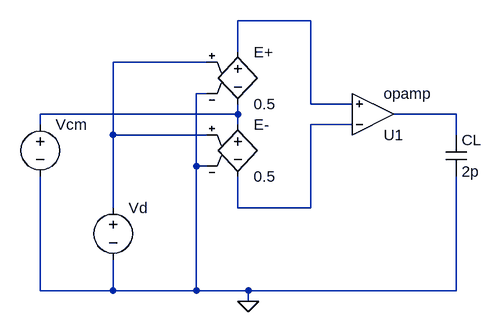
[diagram p0: schematic dc_setup.asc]
dc_setup.asc, the LTspice schematic file:
Version 4
SHEET 1 880 680
WIRE 192 48 80 48
WIRE 80 96 80 48
WIRE 32 112 -112 112
WIRE 32 160 16 160
WIRE 192 176 192 48
WIRE 256 176 192 176
WIRE 80 192 80 176
WIRE 80 192 -224 192
WIRE 416 192 320 192
WIRE -224 208 -224 192
WIRE 80 208 80 192
WIRE 256 208 192 208
WIRE -112 224 -112 112
WIRE 32 224 -112 224
WIRE 416 224 416 192
WIRE 16 272 16 160
WIRE 32 272 16 272
WIRE -112 336 -112 224
WIRE 80 336 80 288
WIRE 192 336 192 208
WIRE 192 336 80 336
WIRE -224 464 -224 288
WIRE -112 464 -112 416
WIRE -112 464 -224 464
WIRE 16 464 16 272
WIRE 16 464 -112 464
WIRE 96 464 16 464
WIRE 416 464 416 288
WIRE 416 464 96 464
WIRE 96 480 96 464
FLAG 96 480 0
SYMBOL voltage -224 192 R0
SYMATTR InstName Vcm
SYMATTR Value ""
SYMBOL voltage -112 320 R0
SYMATTR InstName Vd
SYMATTR Value ""
SYMBOL e 80 80 R0
SYMATTR InstName E+
SYMATTR Value 0.5
SYMBOL e 80 192 R0
SYMATTR InstName E-
SYMATTR Value 0.5
SYMBOL Opamps\\opamp 288 256 M180
SYMATTR InstName U1
SYMBOL cap 400 224 R0
SYMATTR InstName CL
SYMATTR Value 2p

The netlist it stands for:
* dc_setup.asc
Vcm N003 0
Vd N002 0
E+ N001 N003 N002 0 0.5
E- N003 N005 N002 0 0.5
XU1 N005 N001 N004 opamp Aol=100K GBW=10Meg  ; pins invin noninvin out
CL N004 0 2p
.backanno
.end